# Altium project VayTay.PrjPcb
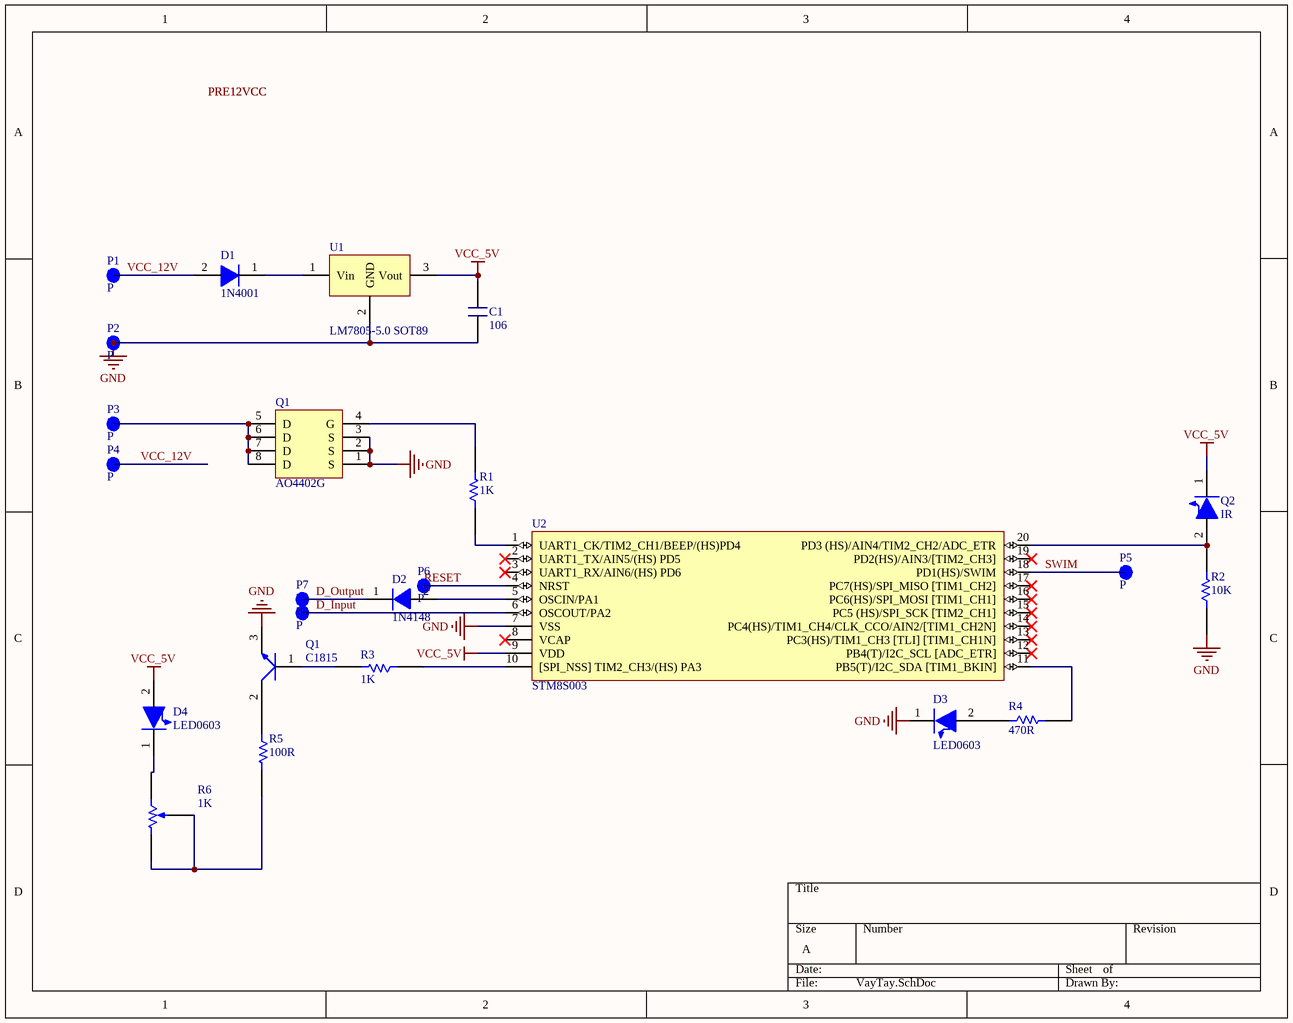
[diagram p0: VayTay.SchDoc]
1 sheet, 24 parts. Net scope: global (net labels, ports and power ports of the same name join across sheets).

## Sheet VayTay.SchDoc
size A

### Parts
(Parts that share a designator on the sheet are numbered #1, #2 ... from top to bottom, then left to right.)
C1  106
D1  1N4001  [SODFL504X244-2N]
D2  1N4148  [DIOMELF3515N]
D3  LED0603  [DIOC1608X06N]
D4  LED0603  [DIOC1608X06N]
P1  P
P2  P
P3  P
P4  P
P5  P
P6  P
P7  P
P8  P
Q1#1  AO4402G
Q1#2  C1815  [SOT95P278X125-3N]
Q2  IR  [DIOC1608X06N]
R1  1K  [RESC2608X06N_0603]
R2  10K  [RESC2608X06N_0603]
R3  1K  [RESC2608X06N_0603]
R4  470R  [RESC2608X06N_0603]
R5  100R  [RESC2608X06N_0603]
R6  1K  [Var_SMD_3x3]
U1  LM7805-5.0 SOT89  [SOT89-150P409X160-3N]
U2  STM8S003  [TSOP65P640X120-20N]

### Nets
GND: C1.1 P2.1 Q1#1.1(S) Q1#1.2(S) Q1#1.3(S) Q1#2.3(E) R2.1 U1.2(GND) U2.7(VSS)
VCC_5V: C1.2 D4.2(C) Q2.1(A) U1.3(Vout) U2.9(VDD)
D_Input: P8.1 U2.6(OSCOUT/PA2)
D_Output: D2.1(C) P7.1
RESET: P6.1 U2.4(NRST)
SWIM: P5.1 U2.18(PD1(HS)/SWIM)
VCC_12V: D1.2(A) P1.1 P4.1
NetD1_1: D1.1(C) U1.1(Vin)
NetD2_2: D2.2(A) U2.5(OSCIN/PA1)
NetD3_2: D3.2(C) R4.1
NetD4_1: D4.1(A) R6.1
NetP3_1: P3.1 Q1#1.5(D) Q1#1.6(D) Q1#1.7(D) Q1#1.8(D)
NetQ1#1_4: Q1#1.4(G) R1.2
NetQ1#2_1: Q1#2.1(B) R3.2
NetQ1#2_2: Q1#2.2(C) R5.1
NetQ2_2: Q2.2(C) R2.2 U2.20(PD3_(HS)/AIN4/TIM2_CH2/ADC_ETR)
NetR1_1: R1.1 U2.1(UART1_CK/TIM2_CH1/BEEP/(HS)PD4)
NetR3_1: R3.1 U2.10([SPI_NSS]_TIM2_CH3/(HS)_PA3)
NetR4_2: R4.2 U2.11(PB5(T)/I2C_SDA_[TIM1_BKIN])
NetR5_2: R5.2 R6.2 R6.3

Not connected (* = marked no-connect by the designer): D3 1(A); U2 2(UART1_TX/AIN5/(HS)_PD5)* 3(UART1_RX/AIN6/(HS)_PD6)* 8(VCAP)* 12(PB4(T)/I2C_SCL_[ADC_ETR])* 13(PC3(HS)/TIM1_CH3_[TLI]_[TIM1_CH1N])* 14(PC4(HS)/TIM1_CH4/CLK_CCO/AIN2/[TIM1_CH2N])* 15(PC5_(HS)/SPI_SCK_[TIM2_CH1])* 16(PC6(HS)/SPI_MOSI_[TIM1_CH1])* 17(PC7(HS)/SPI_MISO_[TIM1_CH2])* 19(PD2(HS)/AIN3/[TIM2_CH3])*

### Notes on the sheet
- Labels drawn without touching a wire or pin: GND

### Library data of the parts
C1 = Capacitor 106
D1 = 1N4007_SMD Diode: 1N4007_SMD
D2 = 1N4148_SMD: DIODE GEN PURP 75V 200MA DO213AA; Supplier 1: Digi-Key; Supplier Part Number 1: 1N4148UR-1-ND
P1-P8 = Point
Q1#1 = AO4402G: 20V N-Channel MOSFET
Q1#2 = Transitor C1815 NPN: SOT-23 Plastic-Encapsulate Transistors
Q2 = LED0603
R1 R3 = 1k_0603_5%: Thick Film Resistors - SMD 0603 1kOHMS 5% 1/10WATT; Supplier 1: Digi-Key; Supplier Part Number 1: CR0603-JW-101ELFCT-ND
R2 = R10k_0603_5%: RES SMD 10K OHM 1% 1/4W 0603; Supplier 1: Digi-Key; Supplier Part Number 1: 541-10.0KSCT-ND
R4 = R470_0603_5%: Thick Film Resistors - SMD 470 ohm 5%; Supplier 1: Digi-Key; Supplier Part Number 1: CR0603-JW-471ELFCT-ND
R5 = R100_0603_5%: Thick Film Resistors - SMD 0603 100OHMS 5% 1/10WATT; Supplier 1: Digi-Key; Supplier Part Number 1: CR0603-JW-101ELFCT-ND
R6 = Varistor 3x3 SMD 1KOhm: Varistor 3x3 SMD 1KOhm 5% 1/10WATT; Supplier 1: Digi-Key; Supplier Part Number 1: CR0603-JW-101ELFCT-ND
U1 = LM7805 SOT89
U2 = STM8S003: MCU 8-bit STM8S STM8 CISC 8KB Flash 3.3V/5V 20-Pin TSSOP T/R; Value: STM8S003F3; Supplier Part Number 1: 497-18051-1-ND